# EasyEDA schematic SCH_Force Plate Signal Conditioning Unit_5.22.2022_2023-03-23.json
TITLE: Connections and Power Regulation; REV: 1.0; Date: 2021-12-14; Sheet: 1/1; Drawn By: Alexander Peebles; Company: Community Biomechanics LLC
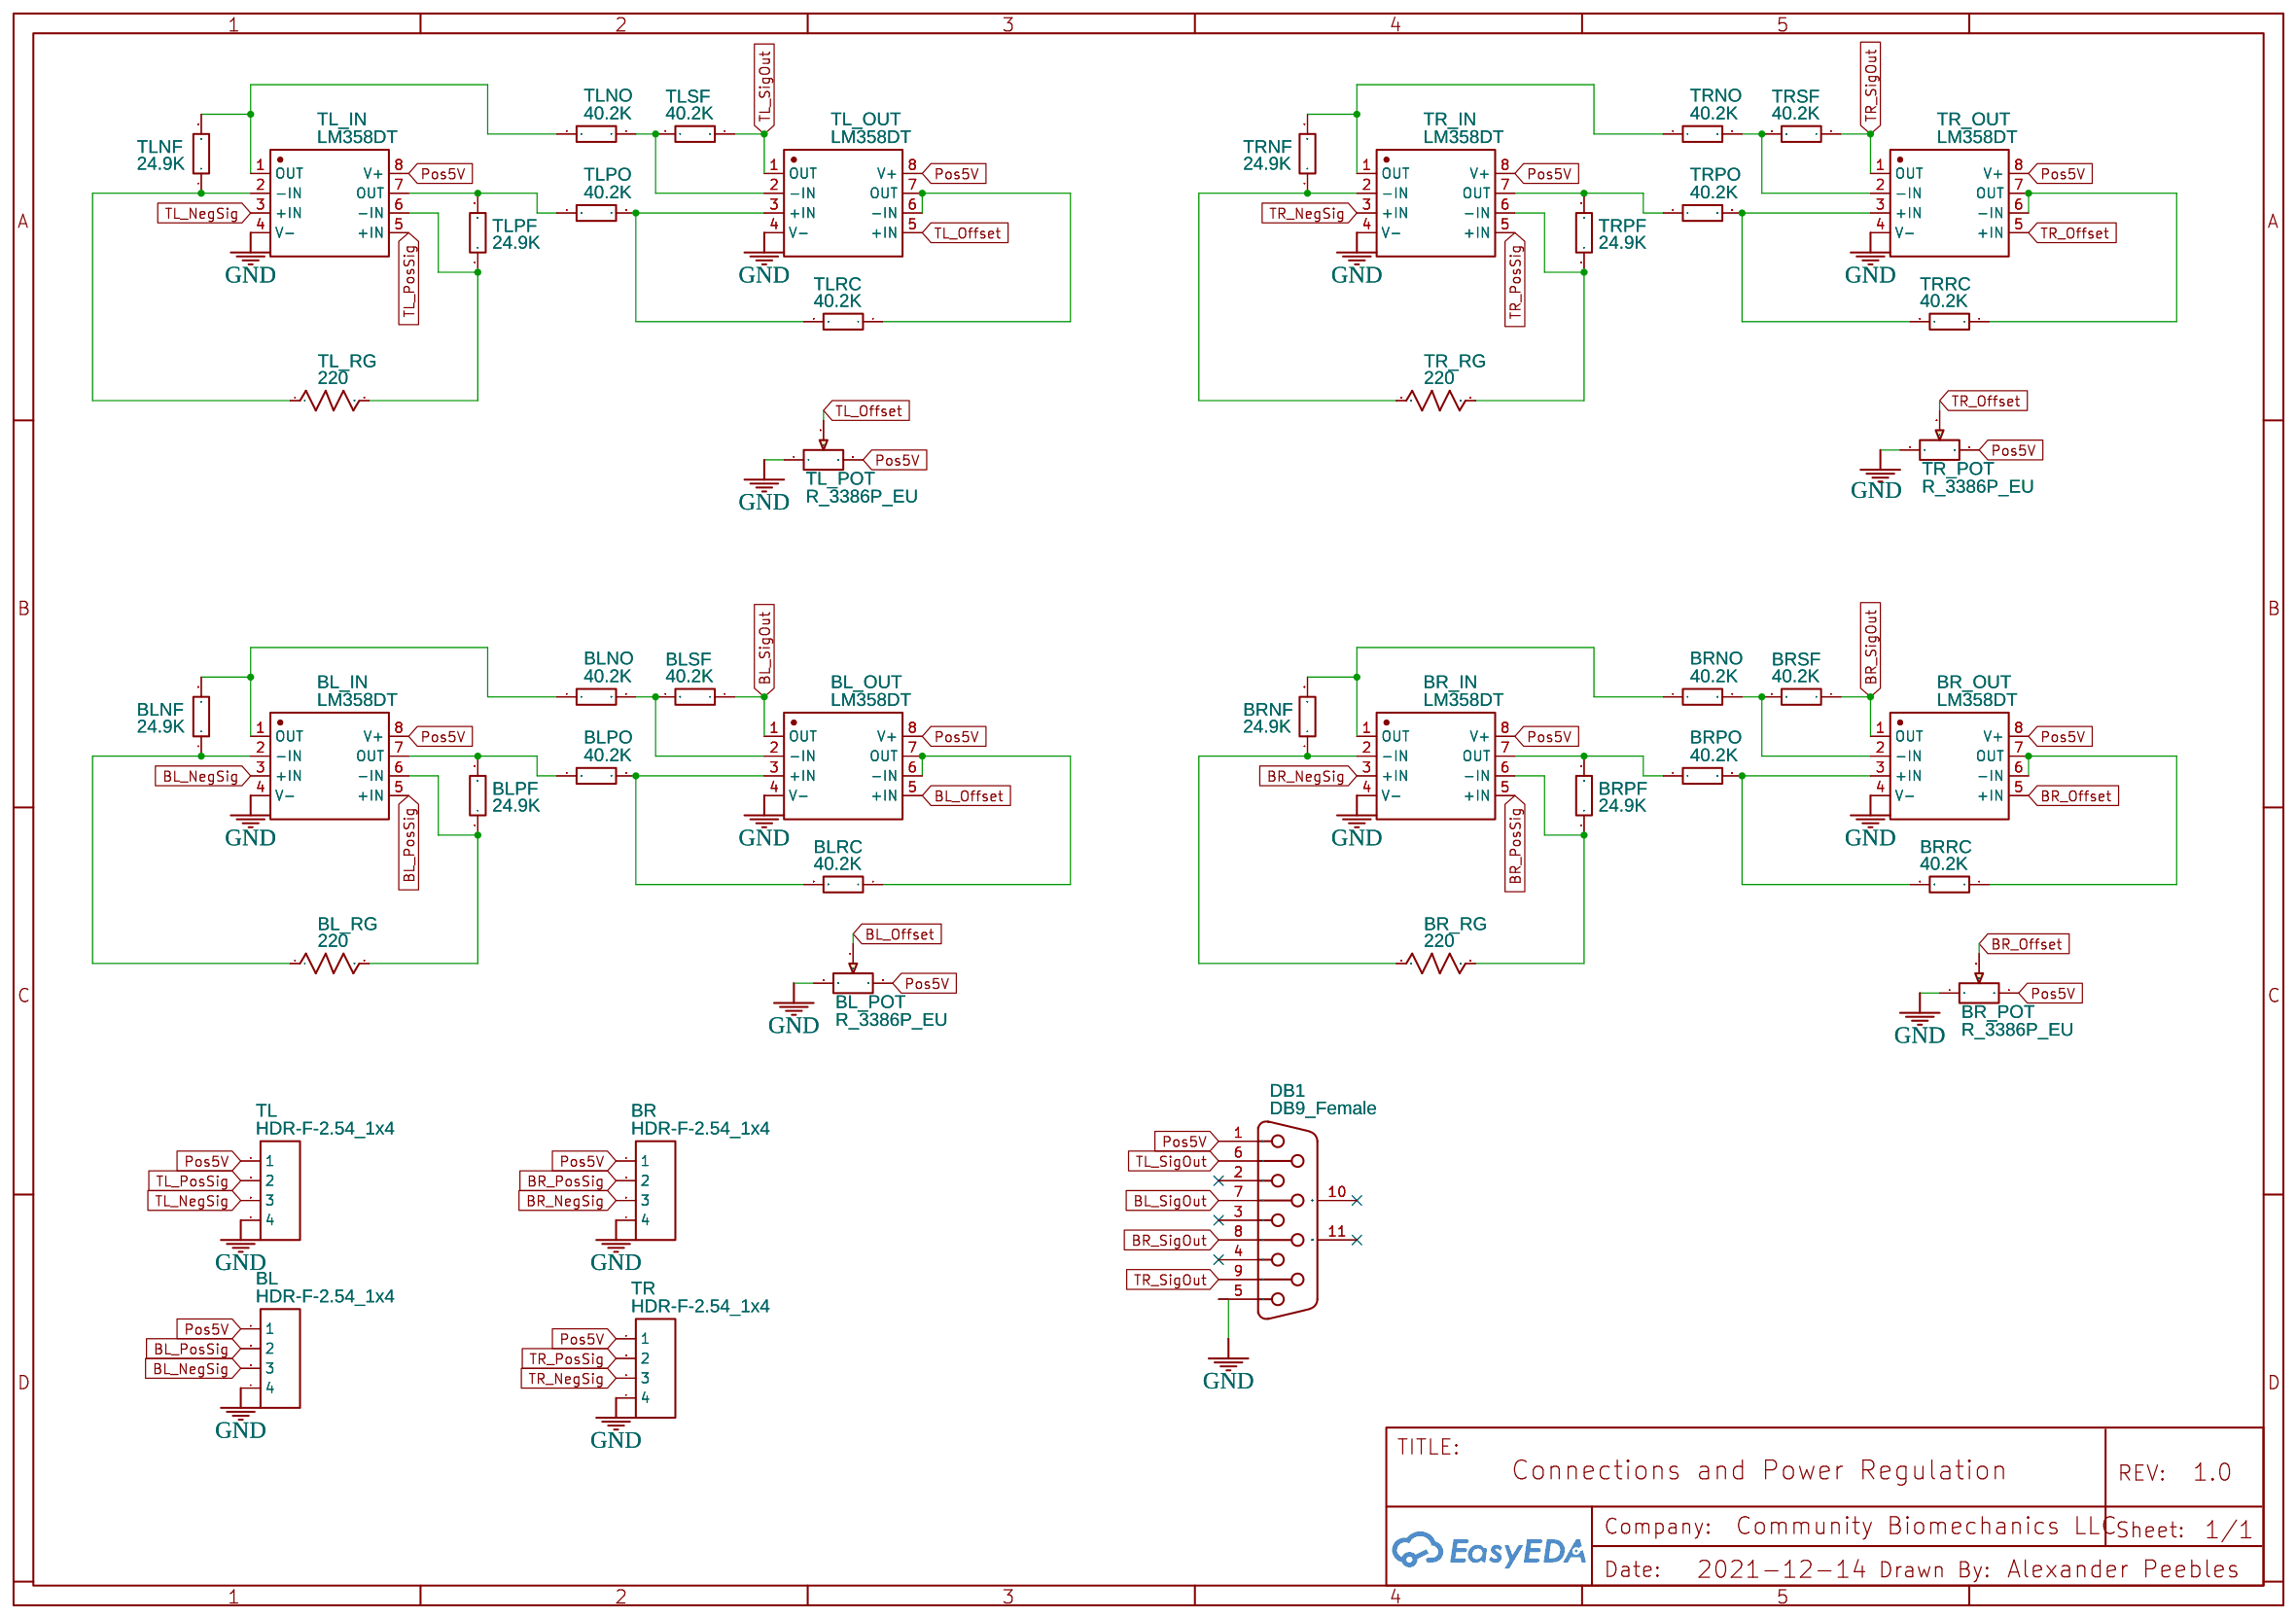
[diagram p0: schematic sheet]

## Parts
BL  HDR-F-2.54_1x4  [HDR-F-2.54_1X4]
BL_IN  LM358DT  [SOIC-8_L5.0-W4.0-P1.27-LS6.0-BL]
BL_OUT  LM358DT  [SOIC-8_L5.0-W4.0-P1.27-LS6.0-BL]
BL_POT  R_3386P_EU  [RES-ADJ-TH_3386P]
BL_RG  220  [R_AXIAL-0.4]
BLNF  24.9K  [R0603]
BLNO  40.2K  [R0603]
BLPF  24.9K  [R0603]
BLPO  40.2K  [R0603]
BLRC  40.2K  [R0603]
BLSF  40.2K  [R0603]
BR  HDR-F-2.54_1x4  [HDR-F-2.54_1X4]
BR_IN  LM358DT  [SOIC-8_L5.0-W4.0-P1.27-LS6.0-BL]
BR_OUT  LM358DT  [SOIC-8_L5.0-W4.0-P1.27-LS6.0-BL]
BR_POT  R_3386P_EU  [RES-ADJ-TH_3386P]
BR_RG  220  [R_AXIAL-0.4]
BRNF  24.9K  [R0603]
BRNO  40.2K  [R0603]
BRPF  24.9K  [R0603]
BRPO  40.2K  [R0603]
BRRC  40.2K  [R0603]
BRSF  40.2K  [R0603]
DB1  DB9_Female  [DSUB-TH_DMR-9S]
TL  HDR-F-2.54_1x4  [HDR-F-2.54_1X4]
TL_IN  LM358DT  [SOIC-8_L5.0-W4.0-P1.27-LS6.0-BL]
TL_OUT  LM358DT  [SOIC-8_L5.0-W4.0-P1.27-LS6.0-BL]
TL_POT  R_3386P_EU  [RES-ADJ-TH_3386P]
TL_RG  220  [R_AXIAL-0.4]
TLNF  24.9K  [R0603]
TLNO  40.2K  [R0603]
TLPF  24.9K  [R0603]
TLPO  40.2K  [R0603]
TLRC  40.2K  [R0603]
TLSF  40.2K  [R0603]
TR  HDR-F-2.54_1x4  [HDR-F-2.54_1X4]
TR_IN  LM358DT  [SOIC-8_L5.0-W4.0-P1.27-LS6.0-BL]
TR_OUT  LM358DT  [SOIC-8_L5.0-W4.0-P1.27-LS6.0-BL]
TR_POT  R_3386P_EU  [RES-ADJ-TH_3386P]
TR_RG  220  [R_AXIAL-0.4]
TRNF  24.9K  [R0603]
TRNO  40.2K  [R0603]
TRPF  24.9K  [R0603]
TRPO  40.2K  [R0603]
TRRC  40.2K  [R0603]
TRSF  40.2K  [R0603]

## Library data of the parts
BL BR TL TR = HDR-F-2.54_1x4: Supplier Part: C225501; Supplier: LCSC; Contributor: LCEDA_Lib
BL_IN BL_OUT BR_IN BR_OUT TL_IN TL_OUT TR_IN TR_OUT = LM358DT: Supplier: LCSC; Manufacturer: STMicroelectronics; Supplier Part: C9418; JLCPCB Part Class: Extended Part
BL_POT BR_POT TL_POT TR_POT = R_3386P_EU: Supplier: LCSC; Contributor: LCEDA_Lib; Value(Ω): 10K
BL_RG BR_RG TL_RG TR_RG = R_AXIAL-0.4_US: Contributor: LCEDA_Lib
BLNF BLPF BRNF BRPF TLNF TLPF TRNF TRPF = 0603WAF2492T5E: Supplier: LCSC; Manufacturer: UniOhm; Supplier Part: C25962; JLCPCB Part Class: Extended Part
BLNO BLPO BLRC BLSF BRNO BRPO BRRC BRSF TLNO TLPO TLRC TLSF TRNO TRPO TRRC TRSF = 0603WAF4022T5E: Supplier: LCSC; Manufacturer: UniOhm; Supplier Part: C12447; JLCPCB Part Class: Basic Part
DB1 = DB9_Female: Supplier Part: C141882; Supplier: LCSC; Manufacturer: Ckmtw(灿科盟); Contributor: LCEDA_Lib

## Nets
GND: BL.4 BL_IN.4(V-) BL_OUT.4(V-) BL_POT.1 BR.4 BR_IN.4(V-) BR_OUT.4(V-) BR_POT.1 DB1.5 TL.4 TL_IN.4(V-) TL_OUT.4(V-) TL_POT.1 TR.4 TR_IN.4(V-) TR_OUT.4(V-) TR_POT.1
BL_NegSig: BL.3 BL_IN.3(+IN)
BL_Offset: BL_OUT.5(+IN) BL_POT.2
BL_PosSig: BL.2 BL_IN.5(+IN)
BL_SigOut: BL_OUT.1(OUT) BLSF.1 DB1.7
BR_NegSig: BR.3 BR_IN.3(+IN)
BR_Offset: BR_OUT.5(+IN) BR_POT.2
BR_PosSig: BR.2 BR_IN.5(+IN)
BR_SigOut: BR_OUT.1(OUT) BRSF.1 DB1.8
Pos5V: BL.1 BL_IN.8(V+) BL_OUT.8(V+) BL_POT.3 BR.1 BR_IN.8(V+) BR_OUT.8(V+) BR_POT.3 DB1.1 TL.1 TL_IN.8(V+) TL_OUT.8(V+) TL_POT.3 TR.1 TR_IN.8(V+) TR_OUT.8(V+) TR_POT.3
TL_NegSig: TL.3 TL_IN.3(+IN)
TL_Offset: TL_OUT.5(+IN) TL_POT.2
TL_PosSig: TL.2 TL_IN.5(+IN)
TL_SigOut: DB1.6 TL_OUT.1(OUT) TLSF.1
TR_NegSig: TR.3 TR_IN.3(+IN)
TR_Offset: TR_OUT.5(+IN) TR_POT.2
TR_PosSig: TR.2 TR_IN.5(+IN)
TR_SigOut: DB1.9 TR_OUT.1(OUT) TRSF.1
Net-(BL_IN-1): BL_IN.1(OUT) BLNF.2 BLNO.1
Net-(BL_IN-2): BL_IN.2(-IN) BL_RG.1 BLNF.1
Net-(BL_IN-6): BL_IN.6(-IN) BL_RG.2 BLPF.1
Net-(BL_IN-7): BL_IN.7(OUT) BLPF.2 BLPO.1
Net-(BL_OUT-2): BL_OUT.2(-IN) BLNO.2 BLSF.2
Net-(BL_OUT-3): BL_OUT.3(+IN) BLPO.2 BLRC.2
Net-(BL_OUT-6): BL_OUT.6(-IN) BL_OUT.7(OUT) BLRC.1
Net-(BR_IN-1): BR_IN.1(OUT) BRNF.2 BRNO.1
Net-(BR_IN-2): BR_IN.2(-IN) BR_RG.1 BRNF.1
Net-(BR_IN-6): BR_IN.6(-IN) BR_RG.2 BRPF.1
Net-(BR_IN-7): BR_IN.7(OUT) BRPF.2 BRPO.1
Net-(BR_OUT-2): BR_OUT.2(-IN) BRNO.2 BRSF.2
Net-(BR_OUT-3): BR_OUT.3(+IN) BRPO.2 BRRC.2
Net-(BR_OUT-6): BR_OUT.6(-IN) BR_OUT.7(OUT) BRRC.1
Net-(TL_IN-1): TL_IN.1(OUT) TLNF.2 TLNO.1
Net-(TL_IN-2): TL_IN.2(-IN) TL_RG.1 TLNF.1
Net-(TL_IN-6): TL_IN.6(-IN) TL_RG.2 TLPF.1
Net-(TL_IN-7): TL_IN.7(OUT) TLPF.2 TLPO.1
Net-(TL_OUT-2): TL_OUT.2(-IN) TLNO.2 TLSF.2
Net-(TL_OUT-3): TL_OUT.3(+IN) TLPO.2 TLRC.2
Net-(TL_OUT-6): TL_OUT.6(-IN) TL_OUT.7(OUT) TLRC.1
Net-(TR_IN-1): TR_IN.1(OUT) TRNF.2 TRNO.1
Net-(TR_IN-2): TR_IN.2(-IN) TR_RG.1 TRNF.1
Net-(TR_IN-6): TR_IN.6(-IN) TR_RG.2 TRPF.1
Net-(TR_IN-7): TR_IN.7(OUT) TRPF.2 TRPO.1
Net-(TR_OUT-2): TR_OUT.2(-IN) TRNO.2 TRSF.2
Net-(TR_OUT-3): TR_OUT.3(+IN) TRPO.2 TRRC.2
Net-(TR_OUT-6): TR_OUT.6(-IN) TR_OUT.7(OUT) TRRC.1

Not connected (* = marked no-connect by the designer): DB1 2* 3* 4* 10(MH1)* 11(MH2)*
